# Altium schematic sheet st-link.SchDoc
size A4
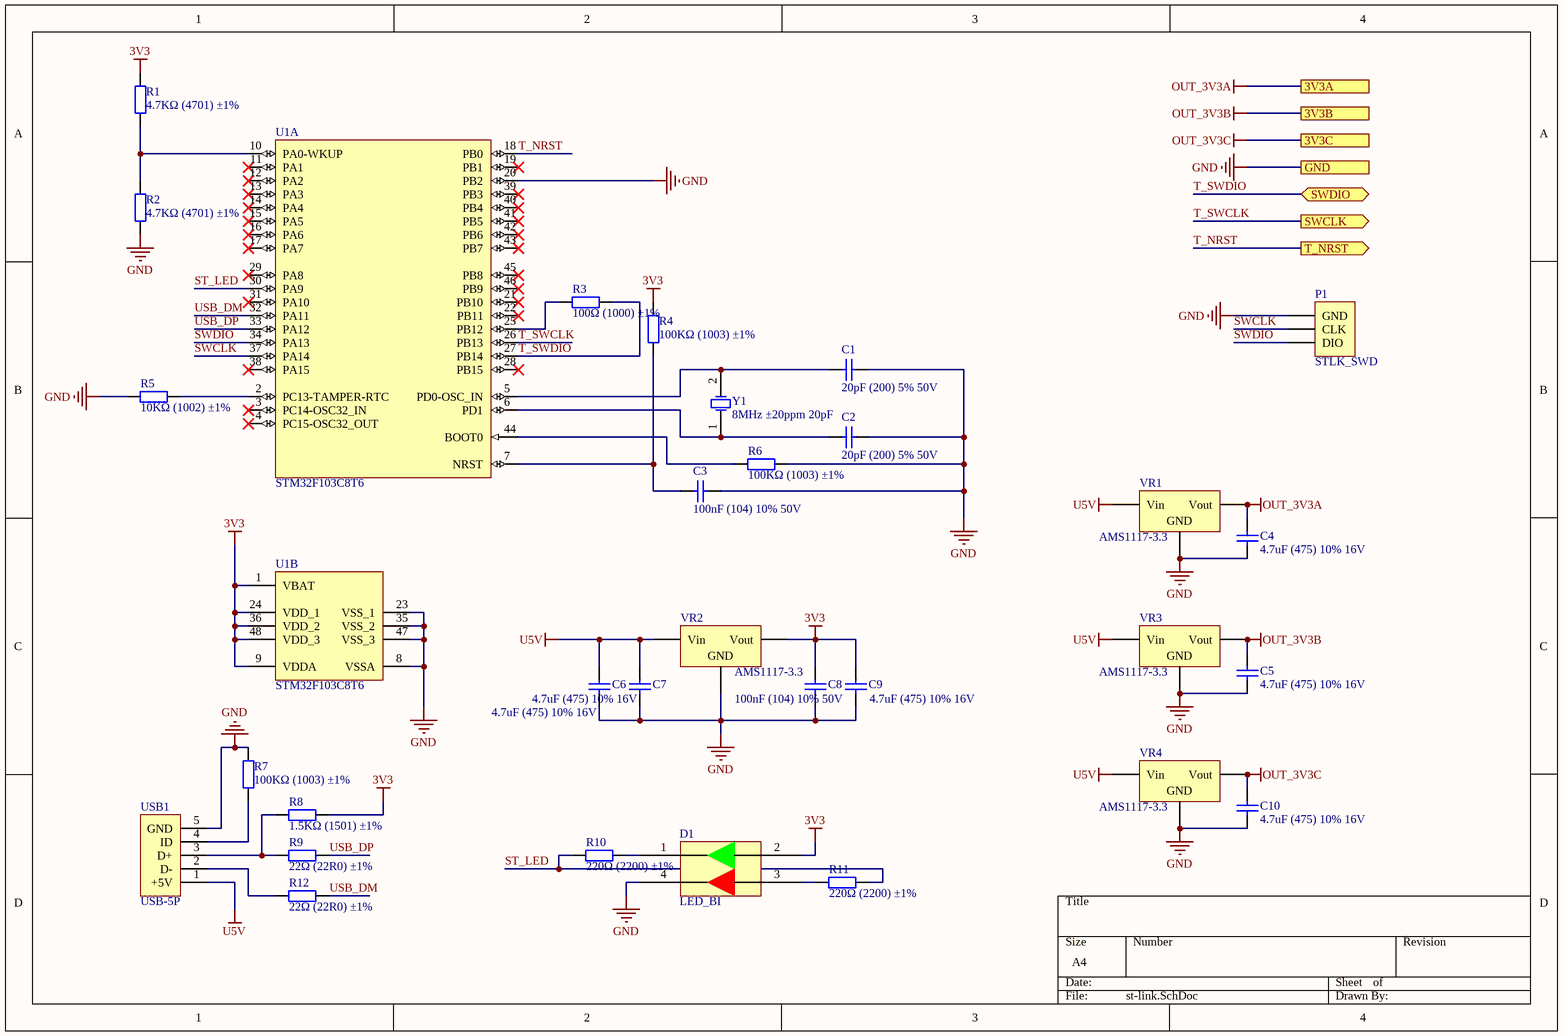
[diagram p0: st-link.SchDoc]

## Parts
C1  20pF (200) 5% 50V  [0603_C]
C2  20pF (200) 5% 50V  [0603_C]
C3  100nF (104) 10% 50V  [0603_C]
C4  4.7uF (475) 10% 16V  [0603_C]
C5  4.7uF (475) 10% 16V  [0603_C]
C6  4.7uF (475) 10% 16V  [0603_C]
C7  4.7uF (475) 10% 16V  [0603_C]
C8  100nF (104) 10% 50V  [0603_C]
C9  4.7uF (475) 10% 16V  [0603_C]
C10  4.7uF (475) 10% 16V  [0603_C]
D1  LED_BI  [LED_BI]
P1  STLK_SWD  [HDR1X3]
R1  4.7KΩ (4701) ±1%  [0603_R]
R2  4.7KΩ (4701) ±1%  [0603_R]
R3  100Ω (1000) ±1%  [0603_R]
R4  100KΩ (1003) ±1%  [0603_R]
R5  10KΩ (1002) ±1%  [0603_R]
R6  100KΩ (1003) ±1%  [0603_R]
R7  100KΩ (1003) ±1%  [0603_R]
R8  1.5KΩ (1501) ±1%  [0603_R]
R9  22Ω (22R0) ±1%  [0603_R]
R10  220Ω (2200) ±1%  [0603_R]
R11  220Ω (2200) ±1%  [0603_R]
R12  22Ω (22R0) ±1%  [0603_R]
U1  STM32F103C8T6  [LQFP-48_7x7x05P]  (parts A,B of 2)
USB1  USB-5P  [USB-MICRO_D]
VR1  AMS1117-3.3  [SOT-223]
VR2  AMS1117-3.3  [SOT-223]
VR3  AMS1117-3.3  [SOT-223]
VR4  AMS1117-3.3  [SOT-223]
Y1  8MHz ±20ppm 20pF  [SMD-5032_2P]

## Ports
3V3A, 3V3B, 3V3C, GND, SWCLK (out), SWDIO (bidir), T_NRST (out)

## Nets
3V3: C8.2 C9.2 D1.2 R1.2 R4.2 R8.2 U1.1(VBAT) U1.9(VDDA) U1.24(VDD_1) U1.36(VDD_2) U1.48(VDD_3) VR2.2(Vout)
GND: C1.2 C2.2 C3.1 C4.1 C5.1 C6.1 C7.1 C8.1 C9.1 C10.1 D1.4 P1.1(GND) R2.1 R5.1 R6.2 R7.2 U1.8(VSSA) U1.20(PB2) U1.23(VSS_1) U1.35(VSS_2) U1.47(VSS_3) USB1.5(GND) VR1.1(GND) VR2.1(GND) VR3.1(GND) VR4.1(GND) ; port GND
OUT_3V3A: C4.2 VR1.2(Vout) ; port 3V3A
OUT_3V3B: C5.2 VR3.2(Vout) ; port 3V3B
OUT_3V3C: C10.2 VR4.2(Vout) ; port 3V3C
U5V: C6.2 C7.2 USB1.1(+5V) VR1.3(Vin) VR2.3(Vin) VR3.3(Vin) VR4.3(Vin)
ST_LED: R10.1 R11.2 U1.30(PA9)
SWCLK: P1.2(CLK) U1.37(PA14)
SWDIO: P1.3(DIO) U1.34(PA13)
T_NRST: U1.18(PB0) ; port T_NRST
T_SWCLK: U1.26(PB13) ; port SWCLK
T_SWDIO: R3.2 U1.27(PB14) ; port SWDIO
USB_DM: R12.2 U1.32(PA11)
USB_DP: R9.2 U1.33(PA12)
NetC1_1: C1.1 U1.5(PD0-OSC_IN) Y1.2(OSC2)
NetC2_1: C2.1 U1.6(PD1) Y1.1(OSC1)
NetC3_2: C3.2 R4.1 U1.7(NRST)
NetD1_1: D1.1 R10.2
NetD1_3: D1.3 R11.1
NetR1_1: R1.1 R2.2 U1.10(PA0-WKUP)
NetR3_1: R3.1 U1.25(PB12)
NetR5_2: R5.2 U1.2(PC13-TAMPER-RTC)
NetR6_1: R6.1 U1.44(BOOT0)
NetR7_1: R7.1 USB1.4(ID)
NetR8_1: R8.1 R9.1 USB1.3(D+)
NetR12_1: R12.1 USB1.2(D-)

Not connected (* = marked no-connect by the designer): U1 3(PC14-OSC32_IN)* 4(PC15-OSC32_OUT)* 11(PA1)* 12(PA2)* 13(PA3)* 14(PA4)* 15(PA5)* 16(PA6)* 17(PA7)* 19(PB1)* 21(PB10)* 22(PB11)* 28(PB15)* 29(PA8)* 31(PA10)* 38(PA15)* 39(PB3)* 40(PB4)* 41(PB5)* 42(PB6)* 43(PB7)* 45(PB8)* 46(PB9)*

## Library data of the parts
C1 C2 = 0603 20pF (200) 5% 50V: 贴片电容; ComponentLink1Description: 供应商链接; ComponentLink1URL: http://www.szlcsc.com/product/details_2000.html; Package: 0603; Supplier: LC; SuppliersPartNumber: C1648
C3 C8 = 0603 100nF (104) 10% 50V: 贴片电容; ComponentLink1Description: 供应商链接; ComponentLink1URL: http://www.szlcsc.com/product/details_15331.html; Package: 0603; Supplier: LC; SuppliersPartNumber: C14663
C4-C7 C9 C10 = 0603 4.7uF (475) 10% 16V: 贴片电容; ComponentLink1Description: 供应商链接; ComponentLink1URL: http://www.szlcsc.com/product/details_20375.html; Package: 0603; Supplier: LC; SuppliersPartNumber: C19666
P1 = Header 3: Header, 3-Pin; LatestRevisionDate: 17-Jul-2002; LatestRevisionNote: Re-released for DXP Platform.; Publisher: Altium Limited
R1 R2 = 0603 4.7KΩ (4701) 1%: 贴片电阻; ComponentLink1Description: 供应商链接; ComponentLink1URL: http://www.szlcsc.com/product/details_23889.html; Package: 0603; Supplier: LC; SuppliersPartNumber: C23162
R3 = 0603 100Ω (1000) 1%: 贴片电阻; ComponentLink1Description: 供应商链接; ComponentLink1URL: http://www.szlcsc.com/product/details_23502.html; Package: 0603; Supplier: LC; SuppliersPartNumber: C22775
R4 R6 R7 = 0603 100KΩ (1003) 1%: 贴片电阻; ComponentLink1Description: 供应商链接; ComponentLink1URL: http://www.szlcsc.com/product/details_26546.html; Package: 0603; Supplier: LC; SuppliersPartNumber: C25803
R5 = 0603 10KΩ (1002) 1%: 贴片电阻; ComponentLink1Description: 供应商链接; ComponentLink1URL: http://www.szlcsc.com/product/details_26547.html; Package: 0603; Supplier: LC; SuppliersPartNumber: C25804
R8 = 0603 1.5KΩ (1501) 1%: 贴片电阻; ComponentLink1Description: 供应商链接; ComponentLink1URL: http://www.szlcsc.com/product/details_23570.html; Package: 0603; Supplier: LC; SuppliersPartNumber: C22843
R9 R12 = 0603 22Ω (22R0) 1%: 贴片电阻; ComponentLink1Description: 供应商链接; ComponentLink1URL: http://www.szlcsc.com/product/details_24078.html; Package: 0603; Supplier: LC; SuppliersPartNumber: C23345
R10 R11 = 0603 220Ω (2200) 1%: 贴片电阻; ComponentLink1Description: 供应商链接; ComponentLink1URL: http://www.szlcsc.com/product/details_23689.html; Package: 0603; Supplier: LC; SuppliersPartNumber: C22962
U1 = STM32F103C8T6: ARM; ComponentLink1Description: 供应商链接; ComponentLink1URL: http://www.szlcsc.com/product/details_9243.html; Package: LQFP-48_7x7x05P; Supplier: LC; SuppliersPartNumber: C8734
USB1 = USB-5P: 微型USB母座; 版权归属: 源创客; BOM名称: 微型USB母座; 学习资源: www.ooocke.com
VR1-VR4 = SOT-223 AMS1117-3.3: 低压差线性稳压(LDO); ComponentLink1Description: 供应商链接; ComponentLink1URL: http://www.szlcsc.com/product/details_6652.html; Package: SOT-223; Supplier: LC; SuppliersPartNumber: C6186
Y1 = SMD-5032_2P 8MHz 20ppm 20pF: 贴片晶振; ComponentLink1Description: 供应商链接; ComponentLink1URL: http://www.szlcsc.com/product/details_117214.html; Package: SMD-5032_2P; Supplier: LC; SuppliersPartNumber: C115962